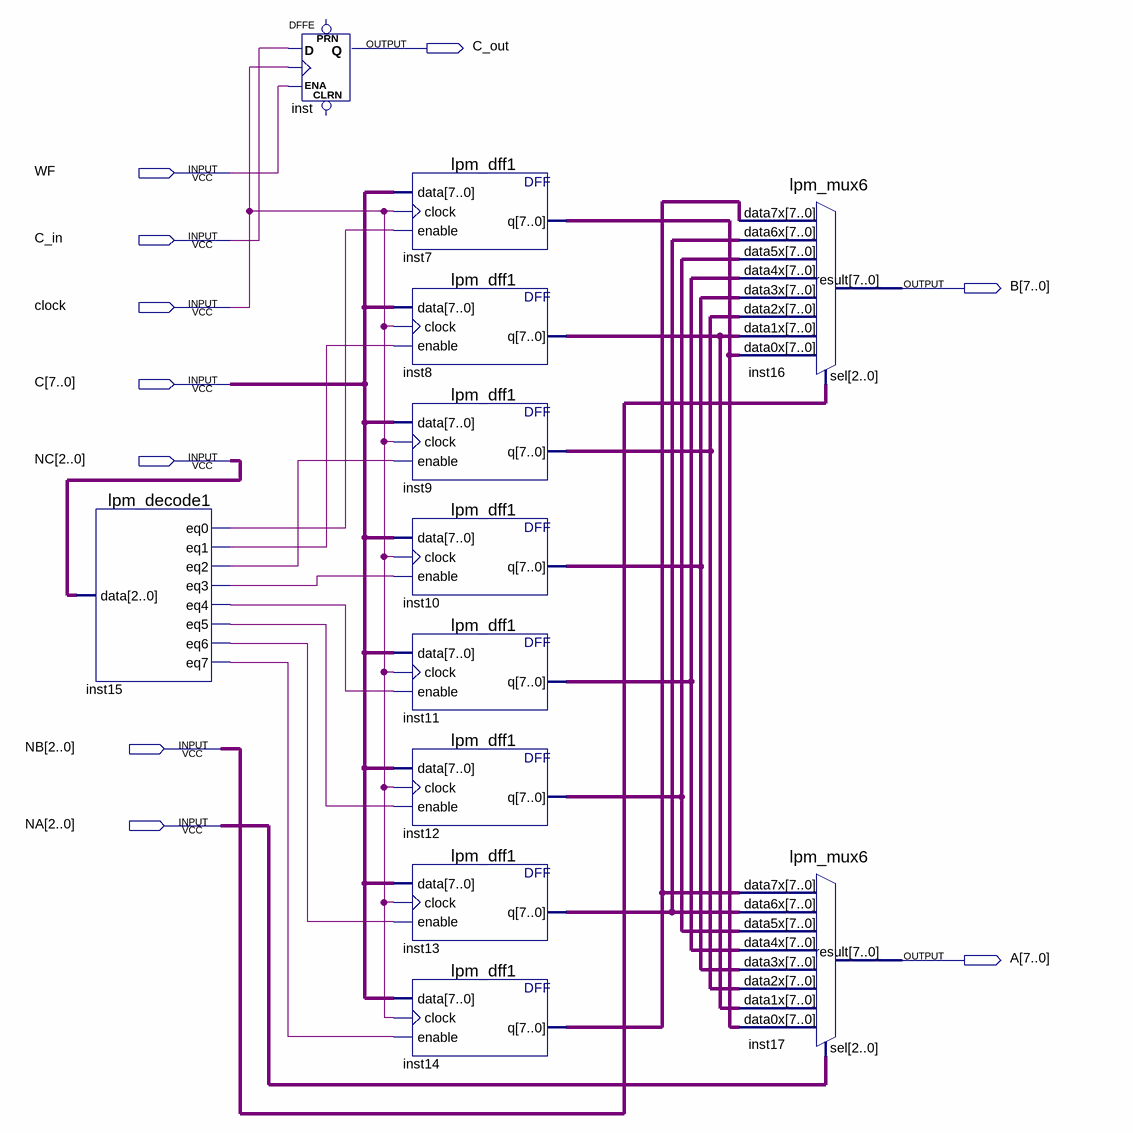
[diagram p0: schematic sheet]
// Quartus schematic TRUE_OU_2.bdf as structural Verilog: 12 symbols, 10 pins
module TRUE_OU_2 (
  input  WF,
  input  C_in,
  input  clock,
  input  [7:0] C,
  input  [2:0] NC,
  input  [2:0] NB,
  input  [2:0] NA,
  output C_out,
  output [7:0] B,
  output [7:0] A
);

  wire inst15_eq0, inst15_eq1, inst15_eq2, inst15_eq3, inst15_eq4, inst15_eq5, inst15_eq6, inst15_eq7;
  wire [7:0] inst7_q, inst8_q, inst9_q, inst10_q, inst11_q, inst12_q, inst13_q, inst14_q;

  lpm_decode1 inst15 (
    .data(NC), .eq0(inst15_eq0), .eq1(inst15_eq1), .eq2(inst15_eq2), .eq3(inst15_eq3), .eq4(inst15_eq4),
    .eq5(inst15_eq5), .eq6(inst15_eq6), .eq7(inst15_eq7));
  DFFE inst (.D(C_in), .CLK(clock), .ENA(WF), .Q(C_out));  // open: PRN, CLRN
  lpm_dff1 inst7 (.data(C), .clock(clock), .enable(inst15_eq0), .q(inst7_q));
  lpm_dff1 inst8 (.data(C), .clock(clock), .enable(inst15_eq1), .q(inst8_q));
  lpm_dff1 inst9 (.data(C), .clock(clock), .enable(inst15_eq2), .q(inst9_q));
  lpm_dff1 inst10 (.data(C), .clock(clock), .enable(inst15_eq3), .q(inst10_q));
  lpm_dff1 inst11 (.data(C), .clock(clock), .enable(inst15_eq4), .q(inst11_q));
  lpm_dff1 inst12 (.data(C), .clock(clock), .enable(inst15_eq5), .q(inst12_q));
  lpm_dff1 inst13 (.data(C), .clock(clock), .enable(inst15_eq6), .q(inst13_q));
  lpm_dff1 inst14 (.data(C), .clock(clock), .enable(inst15_eq7), .q(inst14_q));
  lpm_mux6 inst16 (
    .data7x(inst14_q), .data6x(inst13_q), .data5x(inst12_q), .data4x(inst11_q), .data3x(inst10_q),
    .data2x(inst9_q), .data1x(inst8_q), .data0x(inst7_q), .sel(NB), .result(B));
  lpm_mux6 inst17 (
    .data7x(inst14_q), .data6x(inst13_q), .data5x(inst12_q), .data4x(inst11_q), .data3x(inst10_q),
    .data2x(inst9_q), .data1x(inst8_q), .data0x(inst7_q), .sel(NA), .result(A));
endmodule
